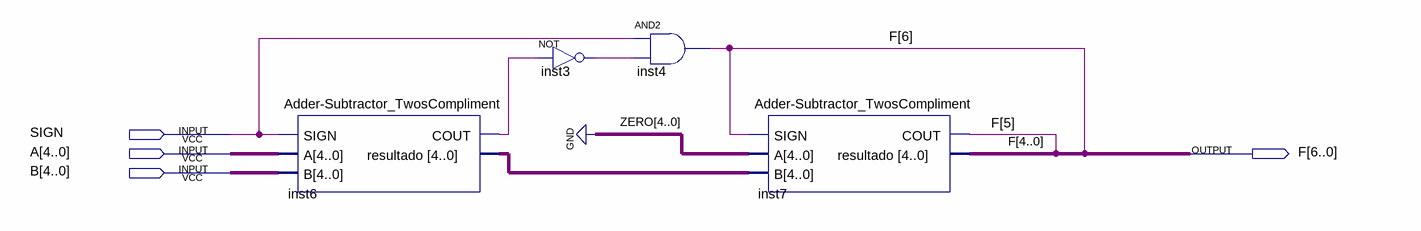
[diagram p0: schematic sheet]
// Quartus schematic Adder-Subtractor.bdf as structural Verilog: 4 symbols, 4 pins
module \Adder-Subtractor  (
  input  SIGN,
  input  [4:0] A,
  input  [4:0] B,
  output [6:0] F
);

  wire inst3_out, inst6_cout;
  wire [4:0] inst6_resultado;

  \Adder-Subtractor_TwosCompliment  inst6 (.SIGN(SIGN), .A(A), .B(B), .COUT(inst6_cout), .resultado(inst6_resultado));
  not inst3 (inst3_out, inst6_cout);
  and inst4 (F[6], SIGN, inst3_out);
  \Adder-Subtractor_TwosCompliment  inst7 (
    .SIGN(F[6]), .A({5{1'b0}}), .B(inst6_resultado), .COUT(F[5]), .resultado(F[4:0]));
endmodule
